# Altium schematic sheet Switches.SchDoc
size Letter; SheetNumber: 3; SheetTotal: 5
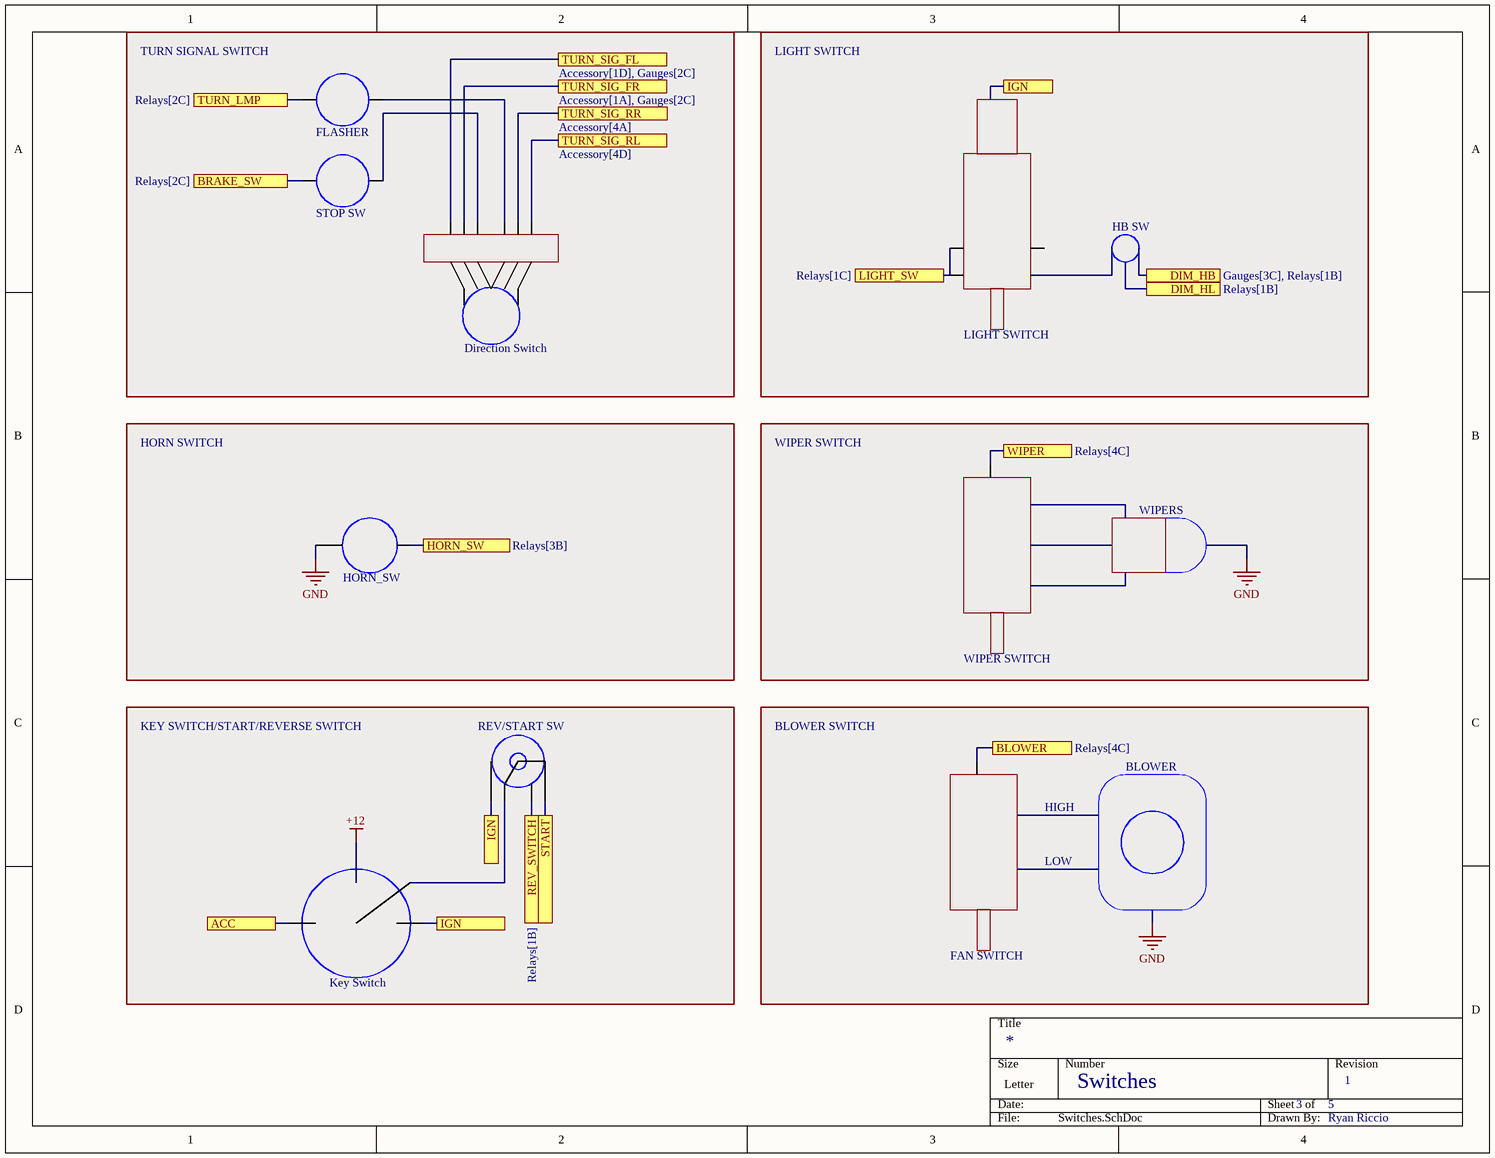
[diagram p0: Switches.SchDoc]

## Ports
ACC (see Accessory[2B], Relays[1A]), BLOWER (see Relays[4C]), BRAKE_SW (see Relays[2C]), DIM_HB (see Gauges[3C], Relays[1B]), DIM_HL (see Relays[1B]), HORN_SW (see Relays[3B]), IGN (see Relays[1A], Switches[2C], Switches[2D]), IGN (see Relays[1A], Switches[2C], Switches[3A]), IGN (see Relays[1A], Switches[2D], Switches[3A]), LIGHT_SW (see Relays[1C]), REV_SWITCH (see Relays[1B]), START (see Engine[1C], Relays[1A]), TURN_LMP (see Relays[2C]), TURN_SIG_FL (see Accessory[1D], Gauges[2C]), TURN_SIG_FR (see Accessory[1A], Gauges[2C]), TURN_SIG_RL (see Accessory[4D]), TURN_SIG_RR (see Accessory[4A]), WIPER (see Relays[4C])

## Notes on the sheet
- TURN SIGNAL SWITCH
- LIGHT SWITCH
- FLASHER
- STOP SW
- HB SW
- Direction Switch
- HORN SWITCH
- WIPER SWITCH
- WIPERS
- HORN_SW
- KEY SWITCH/START/REVERSE SWITCH
- REV/START SW
- BLOWER SWITCH
- BLOWER
- HIGH
- LOW
- FAN SWITCH
- Key Switch
- Switches
- 1
- Ryan Riccio